# EAGLE design tictactoe19_11 (EAGLE 6.4)
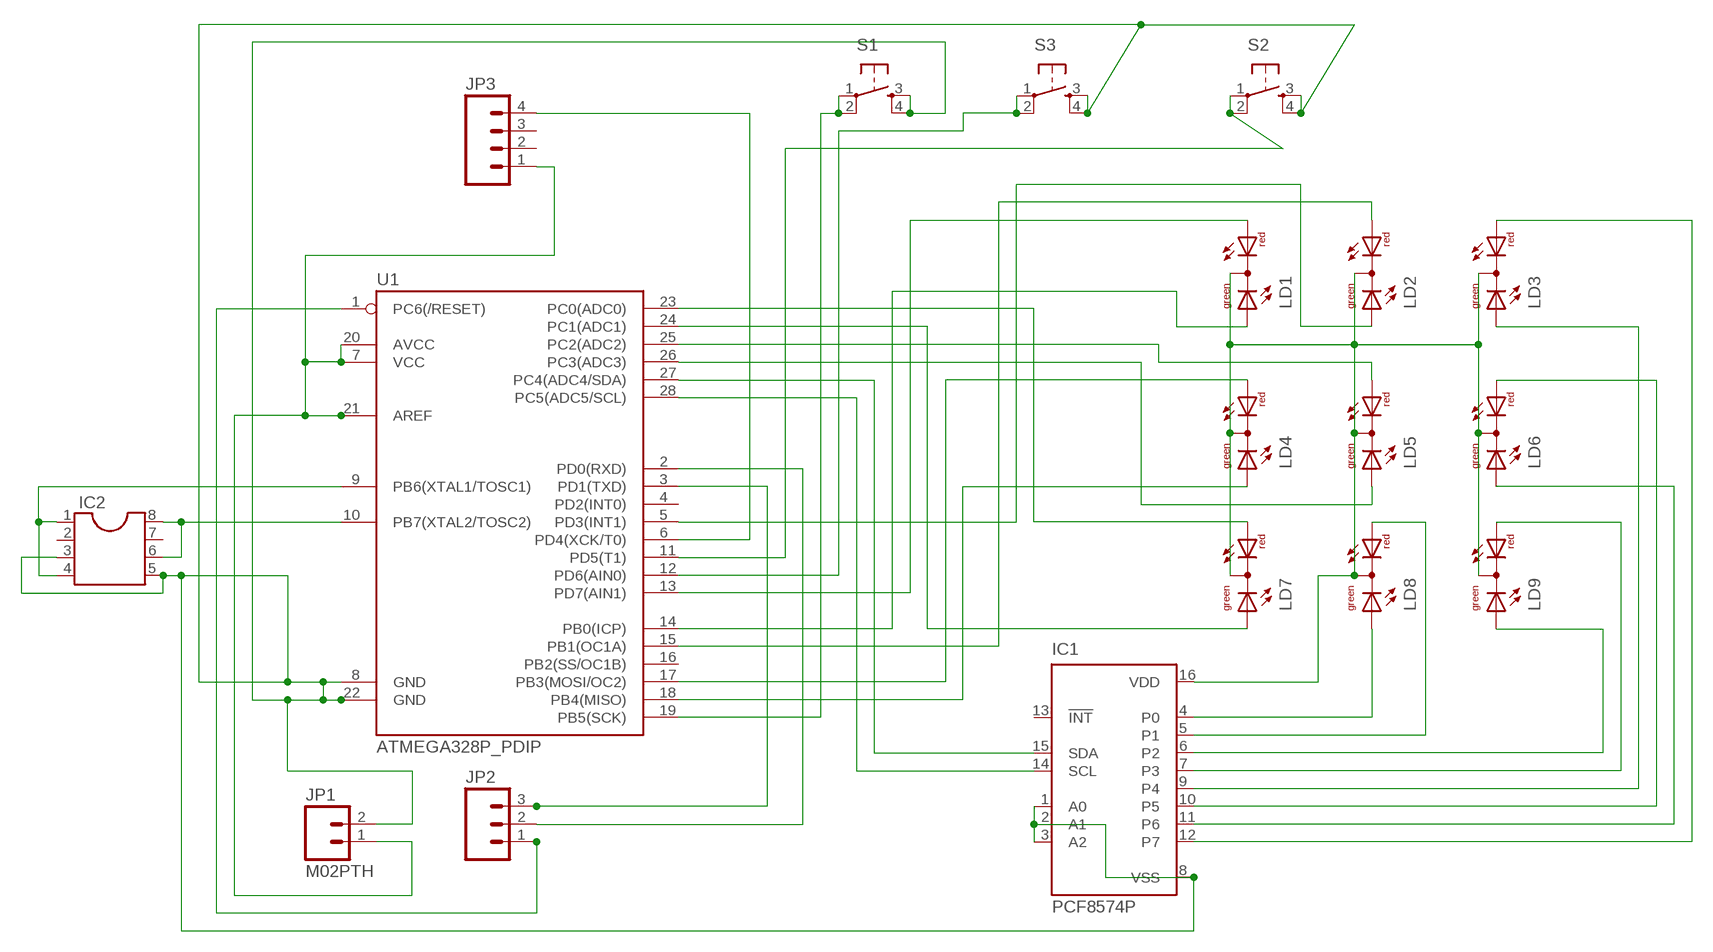
[diagram p0: schematic, sheet 1]

## Parts
IC1  PCF8574P  [DIL16]
IC2  DIL8S  [SOCKET-08]
JP1  M02PTH  [1X02]
JP2  M03PTH  [1X03]
JP3  M04PTH  [1X04]
LD1  DUOLED-RG-C  [DUOLED-C-5MM]
LD2  DUOLED-RG-C  [DUOLED-C-5MM]
LD3  DUOLED-RG-C  [DUOLED-C-5MM]
LD4  DUOLED-RG-C  [DUOLED-C-5MM]
LD5  DUOLED-RG-C  [DUOLED-C-5MM]
LD6  DUOLED-RG-C  [DUOLED-C-5MM]
LD7  DUOLED-RG-C  [DUOLED-C-5MM]
LD8  DUOLED-RG-C  [DUOLED-C-5MM]
LD9  DUOLED-RG-C  [DUOLED-C-5MM]
S1  TAC_SWITCHPTH  [TACTILE-PTH]
S2  TAC_SWITCHPTH  [TACTILE-PTH]
S3  TAC_SWITCHPTH  [TACTILE-PTH]
U1  ATMEGA328P_PDIP  [DIL28-3]

## Nets
GND: IC1.1(A0) IC1.2(A1) IC1.3(A2) IC1.8(VSS) IC2.3 IC2.5 JP1.2 S1.3 S1.4 S2.3 S2.4 S3.3 S3.4 U1.8(GND) U1.22(GND)
N$1: IC2.1 IC2.4 U1.9(PB6(XTAL1/TOSC1))
N$2: JP2.1 U1.1(PC6(/RESET))
N$3: LD1.AX(AG) U1.14(PB0(ICP))
N$4: JP2.3 U1.3(PD1(TXD))
N$5: JP2.2 U1.2(PD0(RXD))
N$6: LD1.AR U1.13(PD7(AIN1))
N$8: IC1.15(SDA) U1.27(PC4(ADC4/SDA))
N$9: IC1.14(SCL) U1.28(PC5(ADC5/SCL))
N$10: S1.1 S1.2 U1.19(PB5(SCK))
N$11: JP3.4 U1.6(PD4(XCK/T0))
N$12: IC2.6 IC2.8 U1.10(PB7(XTAL2/TOSC2))
N$13: S3.1 S3.2 U1.12(PD6(AIN0))
N$14: S2.1 S2.2 U1.11(PD5(T1))
N$15: LD7.AR U1.23(PC0(ADC0))
N$16: LD4.AR U1.17(PB3(MOSI/OC2))
N$17: LD4.AX(AG) U1.18(PB4(MISO))
N$18: LD7.AX(AG) U1.24(PC1(ADC1))
N$19: LD2.AR U1.15(PB1(OC1A))
N$20: LD2.AX(AG) U1.5(PD3(INT1))
N$21: IC1.12(P7) LD3.AR
N$22: IC1.11(P6) LD6.AX(AG)
N$23: IC1.10(P5) LD6.AR
N$24: IC1.9(P4) LD3.AX(AG)
N$25: IC1.7(P3) LD9.AR
N$26: IC1.6(P2) LD9.AX(AG)
N$27: IC1.4(P0) LD8.AX(AG)
N$28: IC1.5(P1) LD8.AR
N$29: LD5.AX(AG) U1.26(PC3(ADC3))
N$31: LD5.AR U1.25(PC2(ADC2))
VCC: IC1.16(VDD) JP1.1 JP3.1 LD1.C LD2.C LD3.C LD4.C LD5.C LD6.C LD7.C LD8.C LD9.C U1.7(VCC) U1.20(AVCC) U1.21(AREF)
Unconnected: IC1.13(!INT) IC2.2 IC2.7 JP3.2 JP3.3 U1.4(PD2(INT0)) U1.16(PB2(SS/OC1B))

## Library data of the parts
IC1 = micro-philips:PCF8574: I2C-Bus Remote 8-bit I/O expander http://www.semiconductors.philips.com/acrobat_download/datasheets/PCF8574_4.pdf; MPN: PCF8574PN; OC_FARNELL: 204020; OC_NEWARK: 11N8515
IC2 = ic-package:DIL8: Dual In Line / Socket
JP1 = SparkFun-Connectors:M02: Standard 2-pin 0.1" header. Use with - straight break away headers ( PRT-00116) - right angle break away headers (PRT-00553) - swiss pins (PRT-00743) - machine pins (PRT-00117) - female headers (PRT-00115) Molex polarized connector foot print use with: PRT-08233 with associated crimp pins and housings. 2.54_SCREWTERM for use with PRT-10571. 3.5mm Screw Terminal footprints for PRT-08084 5mm Screw Terminal footprints for use with PRT-08433
JP2 = SparkFun-Connectors:M03: Header 3 Standard 3-pin 0.1" header. Use with straight break away headers (SKU : PRT-00116), right angle break away headers (PRT-00553), swiss pins (PRT-00743), machine pins (PRT-00117), and female headers (PRT-00115). Molex polarized connector foot print use with SKU : PRT-08232 with associated crimp pins and housings.
JP3 = SparkFun-Connectors:M04: Header 4 Standard 4-pin 0.1" header. Use with straight break away headers (SKU : PRT-00116), right angle break away headers (PRT-00553), swiss pins (PRT-00743), machine pins (PRT-00117), and female headers (PRT-00115). Molex polarized connector foot print use with SKU : PRT-08231 with associated crimp pins and housings. 1MM SMD Version SKU: PRT-10208
LD1-LD9 = led:DUOLED-RG-C: DUO LED 2 colors (red/green), 5 mm, round, common Cathode www.ligitek.com or other producers.
S1-S3 = SparkFun-Electromechanical:TAC_SWITCH: Momentary Switch Button commonly used for reset or general input. Spark Fun Electronics SKU : COM-00097 SMT- SWCH-08247
U1 = SparkFun-DigitalIC:ATMEGA328P_PDIP: uC used in the Arduino 32kb flash, 1k EEPROM, 2k SRAM This is the through-hole version of this chip.

## Board
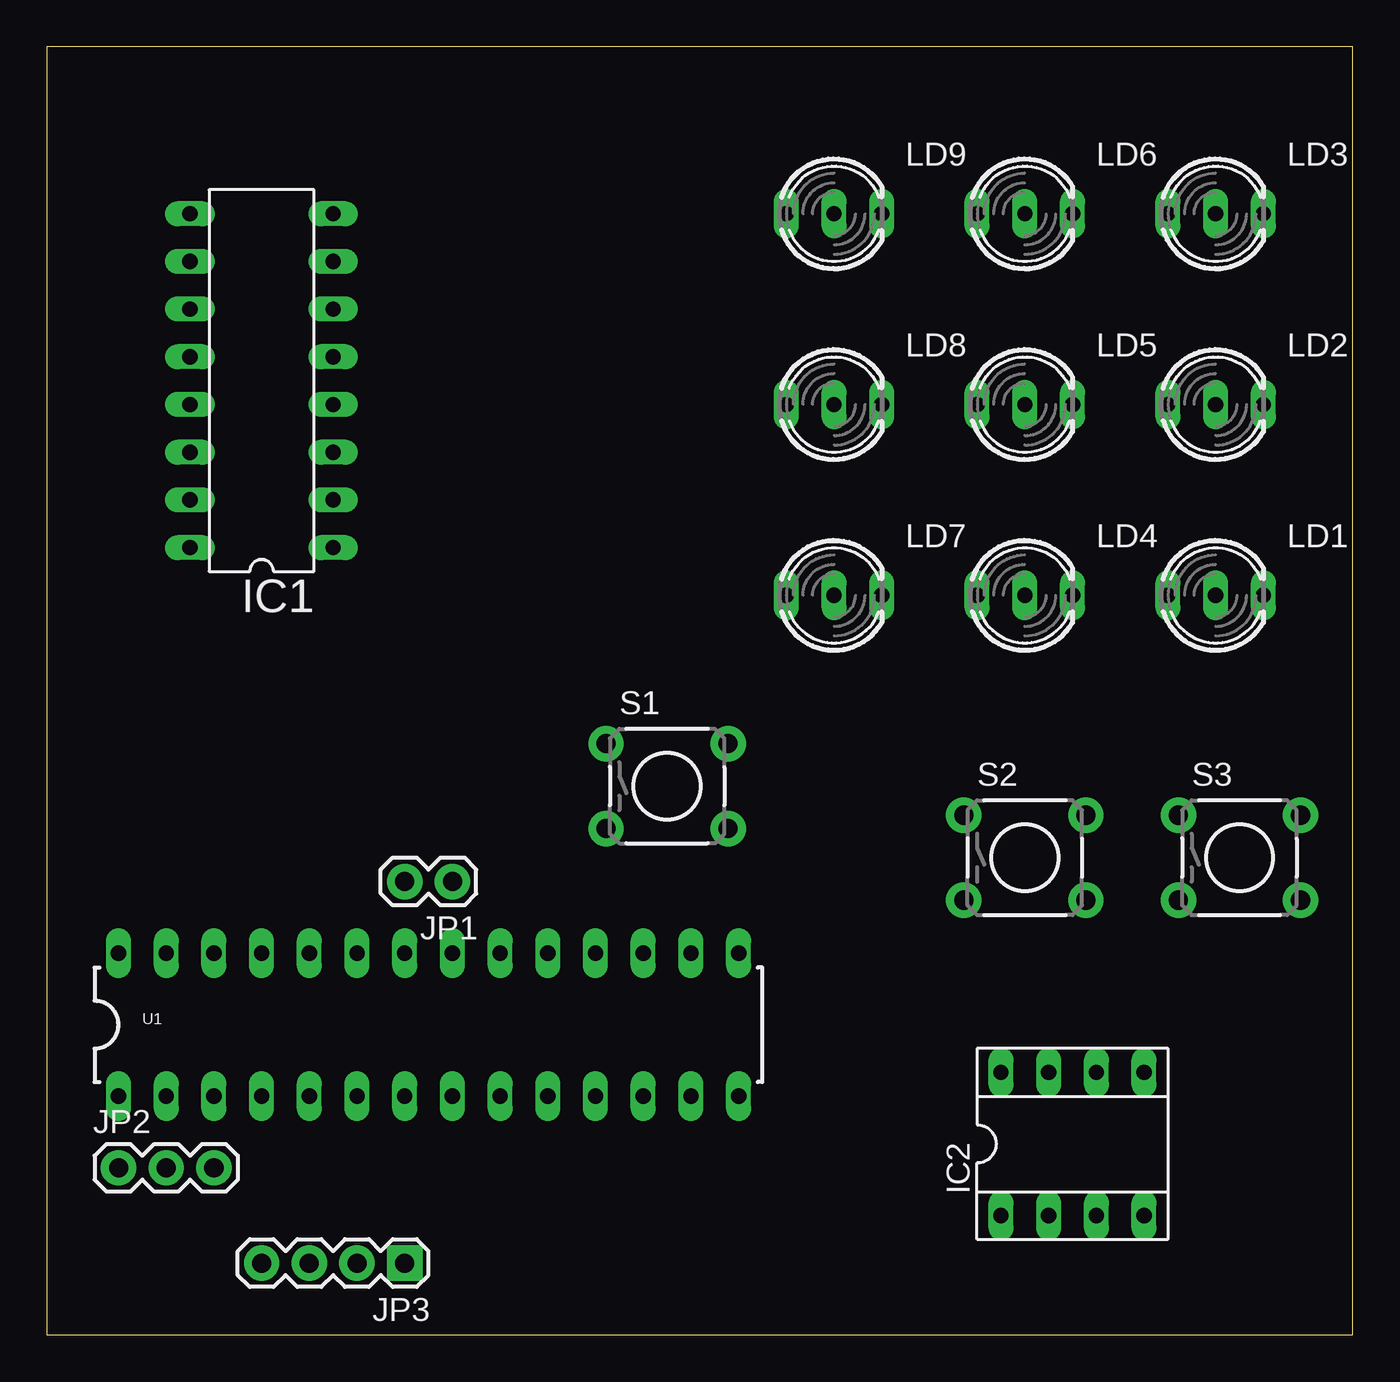
[diagram p1: board, top side]
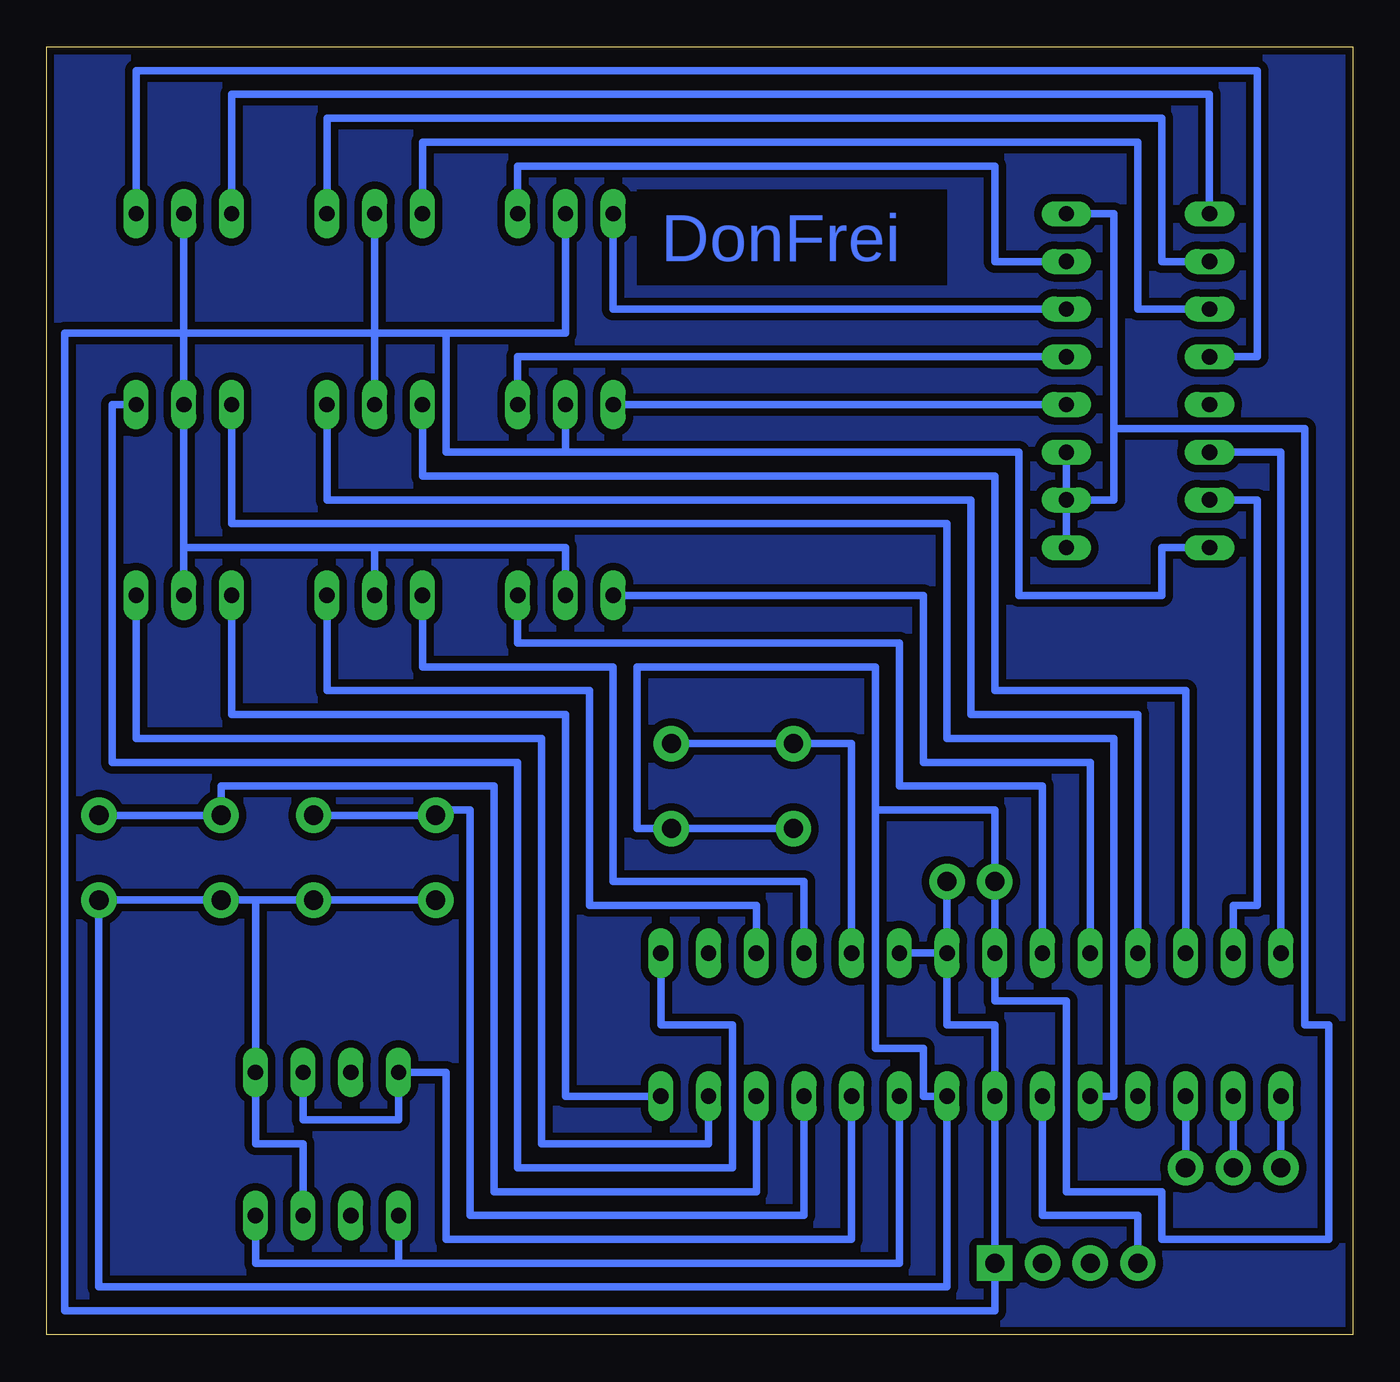
[diagram p2: board, bottom side, seen from below]

Size 69.52 x 68.57 mm. Coordinates in mm from the lower left corner, seen from the top.
Outline: 0,0 69.52,0 69.52,68.57 0,68.57 0,0
Copper layers (1*16): Top 0.035mm / dielectric 1.5mm / Bottom 0.035mm
Design rules "bastli": minimum track width 0.4mm, minimum drill 0.1mm, track to track 0.4mm, track to pad 0.4mm, pad to pad 0.4mm, via to via 0.4mm, smd to smd 0.4mm, copper to edge 0.4mm, drill to drill 0.4mm, minimum pad ring 10mil, minimum via ring 8mil, stop-mask expansion 4mil, vias tented up to drill 0mil, thermal gap 10mil
bRestrict: area 21.6,55.9 to 38.1,61

### Footprints (pad centres in the part's own frame; a part is rotated, then mirrored left to right if it is on the bottom)
DIL16 = drill 0.813 long: 1 -8.89,-3.81; 2 -6.35,-3.81; 3 -3.81,-3.81; 4 -1.27,-3.81; 5 1.27,-3.81; 6 3.81,-3.81; 7 6.35,-3.81; 8 8.89,-3.81; 9 8.89,3.81; 10 6.35,3.81; 11 3.81,3.81; 12 1.27,3.81; 13 -1.27,3.81; 14 -3.81,3.81; 15 -6.35,3.81; 16 -8.89,3.81
SOCKET-08 = drill 0.813 long: 1 -3.81,-3.81; 2 -1.27,-3.81; 3 1.27,-3.81; 4 3.81,-3.81; 5 3.81,3.81; 6 1.27,3.81; 7 -1.27,3.81; 8 -3.81,3.81
1X02 = drill 1.016 pad 1.88: 1 0,0; 2 2.54,0
1X03 = drill 1.016 pad 1.88: 1 0,0; 2 2.54,0; 3 5.08,0
1X04 = drill 1.016 pad 1.88 square: 1 0,0 | drill 1.016 pad 1.88: 2 2.54,0; 3 5.08,0; 4 7.62,0
DUOLED-C-5MM = drill 0.813 long: AR 2.54,0; AX -2.54,0; C 0,0
TACTILE-PTH = drill 1.016 pad 1.88: 1 -3.251,2.261; 2 3.251,2.261; 3 -3.251,-2.261; 4 3.251,-2.261
DIL28-3 = drill 0.813 long: 1 -16.51,-3.81; 2 -13.97,-3.81; 3 -11.43,-3.81; 4 -8.89,-3.81; 5 -6.35,-3.81; 6 -3.81,-3.81; 7 -1.27,-3.81; 8 1.27,-3.81; 9 3.81,-3.81; 10 6.35,-3.81; 11 8.89,-3.81; 12 11.43,-3.81; 13 13.97,-3.81; 14 16.51,-3.81; 15 16.51,3.81; 16 13.97,3.81; 17 11.43,3.81; 18 8.89,3.81; 19 6.35,3.81; 20 3.81,3.81; 21 1.27,3.81; 22 -1.27,3.81; 23 -3.81,3.81; 24 -6.35,3.81; 25 -8.89,3.81; 26 -11.43,3.81; 27 -13.97,3.81; 28 -16.51,3.81

### Placement (x,y rotation side)
IC1  11.43,50.8 90 top
IC2  54.61,10.16 0 top
JP1  21.59,24.13 180 top
JP2  3.81,8.89 0 top
JP3  19.05,3.81 180 top
LD1  62.23,39.37 0 top
LD2  62.23,49.53 0 top
LD3  62.23,59.69 0 top
LD4  52.07,39.37 0 top
LD5  52.07,49.53 0 top
LD6  52.07,59.69 0 top
LD7  41.91,39.37 0 top
LD8  41.91,49.53 0 top
LD9  41.91,59.69 0 top
S1  33.02,29.21 0 top
S2  52.07,25.4 0 top
S3  63.5,25.4 0 top
U1  20.32,16.51 0 top

### Tracks (layer width: path | path; a pad name or v marks a point on that pad's centre or on a via)
GND
  Bottom 0.406: 58.42,23.14 S3.3 S3.4 66.75,2.54 21.59,2.54 U1.8 22.86,12.7 22.86,15.24 25.4,15.24 25.4,27.94 | 58.42,23.14 S2.4 S2.3 | IC2.3 55.88,10.16 58.42,10.16 IC2.5 58.42,23.14 | 25.4,27.94 25.4,35.56 38.1,35.56 38.1,26.95 S1.4 S1.3 | 25.4,27.94 19.05,27.94 JP1.2 U1.22 19.05,17.78 15.24,17.78 15.24,7.62 10.16,7.62 10.16,5.08 1.27,5.08 1.27,16.51 2.54,16.51 2.54,48.26 12.7,48.26 | IC1.8 12.7,59.69 12.7,48.26 | 12.7,48.26 12.7,44.45 IC1.2 | IC1.2 IC1.1 | IC1.3 IC1.2
N$1
  Bottom 0.406: U1.9 24.13,3.81 50.8,3.81 | IC2.4 58.42,3.81 50.8,3.81 | 50.8,3.81 IC2.1
N$2
  Bottom 0.406: U1.1 JP2.1
N$3
  Bottom 0.406: U1.14 41.91,12.7 41.91,33.02 59.69,33.02 LD1.AX
N$4
  Bottom 0.406: U1.3 JP2.3
N$5
  Bottom 0.406: U1.2 JP2.2
N$6
  Bottom 0.406: U1.13 34.29,10.16 43.18,10.16 43.18,31.75 64.77,31.75 LD1.AR
N$7
  pour Bottom: 0,68.58 69.85,68.58 69.85,0 0,0
N$8
  Bottom 0.406: IC1.15 5.08,44.45 5.08,22.86 6.35,22.86 U1.27
N$9
  Bottom 0.406: IC1.14 3.81,46.99 U1.28
N$10
  Bottom 0.406: U1.19 26.67,31.47 S1.1 S1.2
N$11
  Bottom 0.406: U1.6 16.51,6.35 11.43,6.35 JP3.4
N$12
  Bottom 0.406: U1.10 26.67,5.08 48.26,5.08 48.26,13.97 IC2.8 50.8,11.43 55.88,11.43 IC2.6
N$13
  Bottom 0.406: S3.2 S3.1 60.25,29.21 45.72,29.21 45.72,7.62 31.75,7.62 U1.12
N$14
  Bottom 0.406: S2.2 S2.1 48.82,27.94 46.99,27.94 46.99,6.35 29.21,6.35 U1.11
N$15
  Bottom 0.406: LD7.AR 44.45,36.83 24.13,36.83 24.13,29.21 16.51,29.21 U1.23
N$16
  Bottom 0.406: U1.17 31.75,22.86 40.64,22.86 40.64,34.29 54.61,34.29 LD4.AR
N$17
  Bottom 0.406: U1.18 29.21,24.13 39.37,24.13 39.37,35.56 49.53,35.56 LD4.AX
N$18
  Bottom 0.406: U1.24 13.97,30.48 22.86,30.48 22.86,39.37 LD7.AX
N$19
  Bottom 0.406: U1.15 36.83,16.51 33.02,16.51 33.02,8.89 44.45,8.89 44.45,30.48 66.04,30.48 66.04,49.53 LD2.AR
N$20
  Bottom 0.406: U1.5 12.7,12.7 12.7,31.75 21.59,31.75 21.59,43.18 59.69,43.18 LD2.AX
N$21
  Bottom 0.406: LD3.AR 64.77,67.31 5.08,67.31 5.08,52.07 IC1.12
N$22
  Bottom 0.406: IC1.11 11.43,54.61 11.43,63.5 49.53,63.5 LD6.AX
N$23
  Bottom 0.406: IC1.10 10.16,57.15 10.16,64.77 54.61,64.77 LD6.AR
N$24
  Bottom 0.406: IC1.9 7.62,66.04 59.69,66.04 LD3.AX
N$25
  Bottom 0.406: LD9.AR 44.45,62.23 19.05,62.23 19.05,57.15 IC1.7
N$26
  Bottom 0.406: IC1.6 39.37,54.61 LD9.AX
N$27
  Bottom 0.406: LD8.AX IC1.4
N$28
  Bottom 0.406: LD8.AR 44.45,52.07 IC1.5
N$29
  Bottom 0.406: LD5.AX 49.53,45.72 19.05,45.72 19.05,34.29 8.89,34.29 U1.26
N$31
  Bottom 0.406: LD5.AR 54.61,44.45 20.32,44.45 20.32,33.02 11.43,33.02 U1.25
VCC
  Bottom 0.406: U1.21 21.59,16.51 19.05,16.51 U1.7 JP3.1 19.05,1.27 68.58,1.27 68.58,53.34 62.23,53.34 | LD6.C 52.07,53.34 | LD3.C 62.23,53.34 | 62.23,53.34 LD2.C 62.23,41.91 | LD5.C 52.07,53.34 | LD7.C 41.91,41.91 52.07,41.91 | 52.07,41.91 62.23,41.91 | LD4.C 52.07,41.91 | U1.21 JP1.1 | 48.26,53.34 41.91,53.34 LD9.C | 52.07,53.34 62.23,53.34 | LD1.C 62.23,41.91 | LD8.C 41.91,46.99 | 41.91,46.99 48.26,46.99 48.26,53.34 | 48.26,53.34 52.07,53.34 | U1.21 U1.20 | IC1.16 10.16,41.91 10.16,39.37 17.78,39.37 17.78,46.99 41.91,46.99

### Text on the board
Bottom: DonFrei